# Altium project FastestCar-Motor.PrjPcb
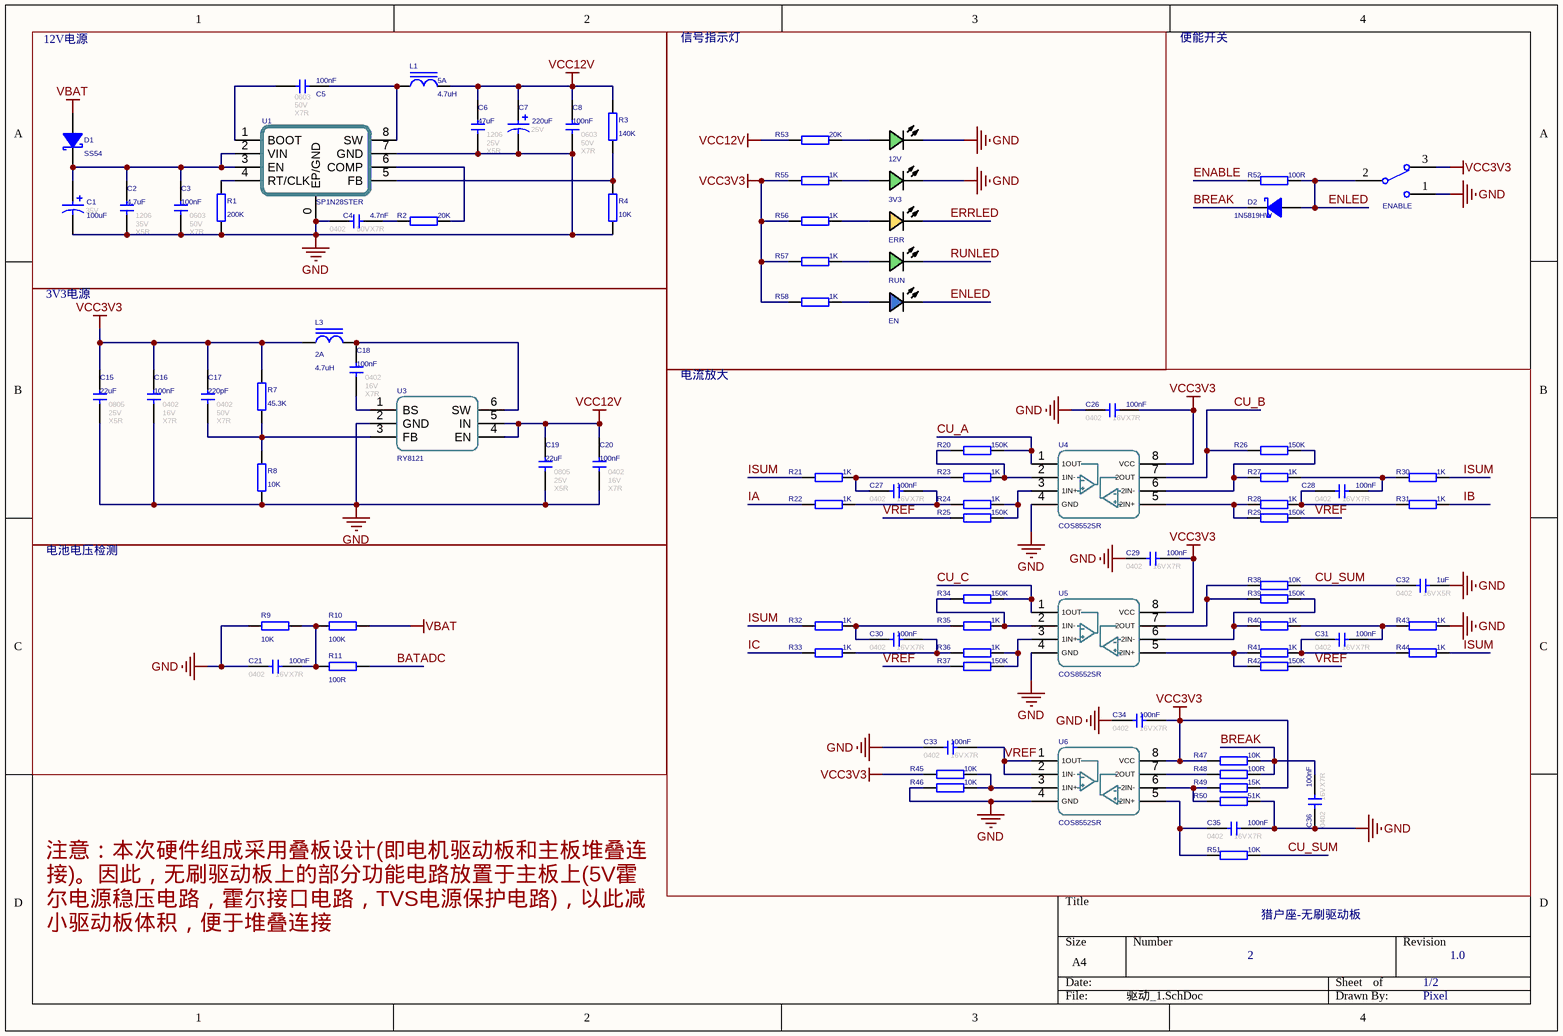
[diagram p0: 驱动_1.SchDoc]
2 sheets, 145 parts. Net scope: global (net labels, ports and power ports of the same name join across sheets).
Board file: 驱动.PcbDoc
Sheets:
  驱动_1.SchDoc
  驱动_2.SchDoc

## Sheet 驱动_1.SchDoc
size A4; SheetNumber: 1; SheetTotal: 2

### Parts
3V3  翠绿贴片LED  [LEDC1608(0603)-L]  (value not drawn)
12V  翠绿贴片LED  [LEDC1608(0603)-L]  (value not drawn)
C1  value 100uF  Voltage: 35V  [CAP-E-S 6.3]  (hidden comment: 100uF 35V 铝电解)
C2  value 4.7uF  FootPrint: 1206  Voltage: 35V  Type: X5R  [CAPC3216[1206]S]  (hidden comment: 4.7uF 35V X5R)
C3  value 100nF  FootPrint: 0603  Voltage: 50V  Type: X7R  [CAPC1608[0603]S-N]  (hidden comment: 100nF 50V X7R)
C4  value 4.7nF  FootPrint: 0402  Voltage: 50V  Type: X7R  [CAPC1005[0402]S-N]  (hidden comment: 4.7nF 50V X7R)
C5  value 100nF  FootPrint: 0603  Voltage: 50V  Type: X7R  [CAPC1608[0603]S-N]  (hidden comment: 100nF 50V X7R)
C6  value 47uF  FootPrint: 1206  Voltage: 25V  Type: X5R  [CAPC3216[1206]S]  (hidden comment: 47uF 25V X5R)
C7  value 220uF  Voltage: 25V  [CAP-E-S 6.3]  (hidden comment: 220uF 25V 铝电解)
C8  value 100nF  FootPrint: 0603  Voltage: 50V  Type: X7R  [CAPC1608[0603]S-N]  (hidden comment: 100nF 50V X7R)
C15  value 22uF  FootPrint: 0805  Voltage: 25V  Type: X5R  [CAPC2012[0805]S-N]  (hidden comment: 22uF 25V X5R)
C16  value 100nF  FootPrint: 0402  Voltage: 16V  Type: X7R  [CAPC1005[0402]S-N]  (hidden comment: 100nF 16V X7R)
C17  value 220pF  FootPrint: 0402  Voltage: 50V  Type: X7R  [CAPC1005[0402]S-N]  (hidden comment: 220pF 50V X7R)
C18  value 100nF  FootPrint: 0402  Voltage: 16V  Type: X7R  [CAPC1005[0402]S-N]  (hidden comment: 100nF 16V X7R)
C19  value 22uF  FootPrint: 0805  Voltage: 25V  Type: X5R  [CAPC2012[0805]S-N]  (hidden comment: 22uF 25V X5R)
C20  value 100nF  FootPrint: 0402  Voltage: 16V  Type: X7R  [CAPC1005[0402]S-N]  (hidden comment: 100nF 16V X7R)
C21  value 100nF  FootPrint: 0402  Voltage: 16V  Type: X7R  [CAPC1005[0402]S-N]  (hidden comment: 100nF 16V X7R)
C26  value 100nF  FootPrint: 0402  Voltage: 16V  Type: X7R  [CAPC1005[0402]S-N]  (hidden comment: 100nF 16V X7R)
C27  value 100nF  FootPrint: 0402  Voltage: 16V  Type: X7R  [CAPC1005[0402]S-N]  (hidden comment: 100nF 16V X7R)
C28  value 100nF  FootPrint: 0402  Voltage: 16V  Type: X7R  [CAPC1005[0402]S-N]  (hidden comment: 100nF 16V X7R)
C29  value 100nF  FootPrint: 0402  Voltage: 16V  Type: X7R  [CAPC1005[0402]S-N]  (hidden comment: 100nF 16V X7R)
C30  value 100nF  FootPrint: 0402  Voltage: 16V  Type: X7R  [CAPC1005[0402]S-N]  (hidden comment: 100nF 16V X7R)
C31  value 100nF  FootPrint: 0402  Voltage: 16V  Type: X7R  [CAPC1005[0402]S-N]  (hidden comment: 100nF 16V X7R)
C32  value 1uF  FootPrint: 0402  Voltage: 16V  Type: X5R  [CAPC1005[0402]S-N]  (hidden comment: 1uF 16V X5R)
C33  value 100nF  FootPrint: 0402  Voltage: 16V  Type: X7R  [CAPC1005[0402]S-N]  (hidden comment: 100nF 16V X7R)
C34  value 100nF  FootPrint: 0402  Voltage: 16V  Type: X7R  [CAPC1005[0402]S-N]  (hidden comment: 100nF 16V X7R)
C35  value 100nF  FootPrint: 0402  Voltage: 16V  Type: X7R  [CAPC1005[0402]S-N]  (hidden comment: 100nF 16V X7R)
C36  value 100nF  FootPrint: 0402  Voltage: 16V  Type: X7R  [CAPC1005[0402]S-N]  (hidden comment: 100nF 16V X7R)
D1  SS54  [SMA-L[DO-214AC]]
D2  1N5819HW  [SOD-123-L]
EN  蓝色贴片LED  [LEDC1608(0603)-L]  (value not drawn)
ENABLE  SW-SPDT  [SS12D10]  (value not drawn)
ERR  黄色贴片LED  [LEDC1608(0603)-L]  (value not drawn)
L1  value 4.7uH  Imax: 5A  [SLO2520]  (hidden comment: 4.7uH 5A)
L3  value 4.7uH  Imax: 2A  [SLO2520]  (hidden comment: 4.7uH 2A)
R1  value 200K  [RESC1005[0402]S-N]  (hidden comment: 200K ±1%)
R2  value 20K  [RESC1005[0402]S-N]  (hidden comment: 20K ±1%)
R3  value 140K  [RESC1005[0402]S-N]  (hidden comment: 140K ±1%)
R4  value 10K  [RESC1005[0402]S-N]  (hidden comment: 10K ±1%)
R7  value 45.3K  [RESC1005[0402]S-N]  (hidden comment: 45.3K ±1%)
R8  value 10K  [RESC1005[0402]S-N]  (hidden comment: 10K ±1%)
R9  value 10K  [RESC1005[0402]S-N]  (hidden comment: 10K ±1%)
R10  value 100K  [RESC1005[0402]S-N]  (hidden comment: 100K ±1%)
R11  value 100R  [RESC1005[0402]S-N]  (hidden comment: 100R ±1%)
R20  value 150K  [RESC1005[0402]S-N]  (hidden comment: 150K ±1%)
R21  value 1K  [RESC1005[0402]S-N]  (hidden comment: 1K ±1%)
R22  value 1K  [RESC1005[0402]S-N]  (hidden comment: 1K ±1%)
R23  value 1K  [RESC1005[0402]S-N]  (hidden comment: 1K ±1%)
R24  value 1K  [RESC1005[0402]S-N]  (hidden comment: 1K ±1%)
R25  value 150K  [RESC1005[0402]S-N]  (hidden comment: 150K ±1%)
R26  value 150K  [RESC1005[0402]S-N]  (hidden comment: 150K ±1%)
R27  value 1K  [RESC1005[0402]S-N]  (hidden comment: 1K ±1%)
R28  value 1K  [RESC1005[0402]S-N]  (hidden comment: 1K ±1%)
R29  value 150K  [RESC1005[0402]S-N]  (hidden comment: 150K ±1%)
R30  value 1K  [RESC1005[0402]S-N]  (hidden comment: 1K ±1%)
R31  value 1K  [RESC1005[0402]S-N]  (hidden comment: 1K ±1%)
R32  value 1K  [RESC1005[0402]S-N]  (hidden comment: 1K ±1%)
R33  value 1K  [RESC1005[0402]S-N]  (hidden comment: 1K ±1%)
R34  value 150K  [RESC1005[0402]S-N]  (hidden comment: 150K ±1%)
R35  value 1K  [RESC1005[0402]S-N]  (hidden comment: 1K ±1%)
R36  value 1K  [RESC1005[0402]S-N]  (hidden comment: 1K ±1%)
R37  value 150K  [RESC1005[0402]S-N]  (hidden comment: 150K ±1%)
R38  value 10K  [RESC1005[0402]S-N]  (hidden comment: 10K ±1%)
R39  value 150K  [RESC1005[0402]S-N]  (hidden comment: 150K ±1%)
R40  value 1K  [RESC1005[0402]S-N]  (hidden comment: 1K ±1%)
R41  value 1K  [RESC1005[0402]S-N]  (hidden comment: 1K ±1%)
R42  value 150K  [RESC1005[0402]S-N]  (hidden comment: 150K ±1%)
R43  value 1K  [RESC1005[0402]S-N]  (hidden comment: 1K ±1%)
R44  value 1K  [RESC1005[0402]S-N]  (hidden comment: 1K ±1%)
R45  value 10K  [RESC1005[0402]S-N]  (hidden comment: 10K ±1%)
R46  value 10K  [RESC1005[0402]S-N]  (hidden comment: 10K ±1%)
R47  value 10K  [RESC1005[0402]S-N]  (hidden comment: 10K ±1%)
R48  value 100R  [RESC1005[0402]S-N]  (hidden comment: 100R ±1%)
R49  value 15K  [RESC1005[0402]S-N]  (hidden comment: 15K ±1%)
R50  value 51K  [RESC1005[0402]S-N]  (hidden comment: 51K ±1%)
R51  value 10K  [RESC1005[0402]S-N]  (hidden comment: 10K ±1%)
R52  value 100R  [RESC1005[0402]S-N]  (hidden comment: 100R ±1%)
R53  value 20K  [RESC1005[0402]S-N]  (hidden comment: 20K ±1%)
R55  value 1K  [RESC1005[0402]S-N]  (hidden comment: 1K ±1%)
R56  value 1K  [RESC1005[0402]S-N]  (hidden comment: 1K ±1%)
R57  value 1K  [RESC1005[0402]S-N]  (hidden comment: 1K ±1%)
R58  value 1K  [RESC1005[0402]S-N]  (hidden comment: 1K ±1%)
RUN  翠绿贴片LED  [LEDC1608(0603)-L]  (value not drawn)
U1  SP1N28STER  [SOP-8E]
U3  RY8121  [SOT-23-6]
U4  COS8552SR  [SOP-8]
U5  COS8552SR  [SOP-8]
U6  COS8552SR  [SOP-8]

### Blocks framed on the sheet
12V电源: C1-C8 D1 L1 R1-R4 U1
信号指示灯: 3V3 12V EN ERR R53 R55-R58 RUN
3V3电源: C15-C20 L3 R7 R8 U3
电流放大: C26-C36 R20-R51 U4-U6
电池电压检测: C21 R9-R11

### Nets
GND: 3V3.C 12V.C C1.2 C2.1 C3.1 C4.1 C6.1 C7.2 C8.1 C15.1 C16.1 C19.1 C20.1 C21.1 C26.1 C29.1 C32.2 C33.1 C34.1 C35.2 C36.1 ENABLE.1 R1.1 R4.1 R8.1 R9.1 R43.1 R46.1 R50.2 U1.0(EP/GND) U1.7(GND) U3.2(GND) U4.4(GND) U5.4(GND) U6.4(GND)
VBAT: D1.A R10.2
VCC3V3: C15.2 C16.2 C17.2 C26.2 C29.2 C34.2 ENABLE.3 L3.1 R7.2 R45.1 R47.1 R49.2 R55.1 R56.1 R57.1 R58.1 U4.8(VCC) U5.8(VCC) U6.8(VCC)
VCC12V: C6.2 C7.1 C8.2 C19.2 C20.2 L1.2 R3.2 R53.1 U3.4(EN) U3.5(IN)
BATADC: R11.2
BREAK: C36.2 D2.K R47.2 R48.2
CU_A: R20.2 U4.1(1OUT)
CU_B: R26.2 U4.7(2OUT)
CU_C: R34.2 U5.1(1OUT)
CU_SUM: C32.1 R38.2 R51.2
ENABLE: R52.1
ENLED: D2.A EN.C ENABLE.2 R52.2
ERRLED: ERR.C
IA: R22.1
IB: R31.1
IC: R33.1
ISUM: R21.1 R30.1 R32.1 R44.1
RUNLED: RUN.C
VREF: C33.2 R25.1 R29.1 R37.1 R42.1 U6.1(1OUT) U6.2(1IN-)
Net3V3_A: 3V3.A R55.2
Net12V_A: 12V.A R53.2
NetC1_1: C1.1 C2.2 C3.2 D1.K U1.2(VIN) U1.3(EN)
NetC4_2: C4.2 R2.1
NetC5_1: C5.1 U1.1(BOOT)
NetC5_2: C5.2 L1.1 U1.8(SW)
NetC17_1: C17.1 R7.1 R8.2 U3.3(FB)
NetC18_1: C18.1 U3.1(BS)
NetC18_2: C18.2 L3.2 U3.6(SW)
NetC21_2: C21.2 R9.2 R10.1 R11.1
NetC27_1: C27.1 R21.2 R23.1
NetC27_2: C27.2 R22.2 R24.1
NetC28_1: C28.1 R27.1 R30.2
NetC28_2: C28.2 R28.1 R31.2
NetC30_1: C30.1 R32.2 R35.1
NetC30_2: C30.2 R33.2 R36.1
NetC31_1: C31.1 R40.1 R43.2
NetC31_2: C31.2 R41.1 R44.2
NetC35_1: C35.1 R51.1 U6.5(2IN+)
NetEN_A: EN.A R58.2
NetERR_A: ERR.A R56.2
NetR1_2: R1.2 U1.4(RT/CLK)
NetR2_2: R2.2 U1.6(COMP)
NetR3_1: R3.1 R4.2 U1.5(FB)
NetR20_1: R20.1 R23.2 U4.2(1IN-)
NetR24_2: R24.2 R25.2 U4.3(1IN+)
NetR26_1: R26.1 R27.2 U4.6(2IN-)
NetR28_2: R28.2 R29.2 U4.5(2IN+)
NetR34_1: R34.1 R35.2 U5.2(1IN-)
NetR36_2: R36.2 R37.2 U5.3(1IN+)
NetR38_1: R38.1 R39.2 U5.7(2OUT)
NetR39_1: R39.1 R40.2 U5.6(2IN-)
NetR41_2: R41.2 R42.2 U5.5(2IN+)
NetR45_2: R45.2 R46.2 U6.3(1IN+)
NetR48_1: R48.1 U6.7(2OUT)
NetR49_1: R49.1 R50.1 U6.6(2IN-)
NetR57_2: R57.2 RUN.A

### Notes on the sheet
- 使能开关
- 猎户座-无刷驱动板
- 注意：本次硬件组成采用叠板设计(即电机驱动板和主板堆叠连接)。因此，无刷驱动板上的部分功能电路放置于主板上(5V霍尔电源稳压电路，霍尔接口电路，TVS电源保护电路)，以此减小驱动板体积，便于堆叠连接
- 2
- 1/2
- 1.0
- Pixel

### Library data of the parts
3V3 12V RUN = LED Chip Green: Published: 8-Jun-2000; Revision: July-2002: Re-released for DXP Platform.; Publisher: Altium Limited; Price(RMB): 0.00
C1 = E-S 100uF 35V 6.3x7.7: 贴片电解电容 100uF 35V 6.3x7.7; Revision: V1.0; Type: 铝电解
C2 = 4.7uF 1206 35V X5R: 贴片瓷片电容; MLCC; 1206(3216);; Revision: V1.0
C3 C5 C8 = 100nF 0603 50V X7R: 贴片瓷片电容; MLCC; 0603(1608);; Revision: V1.0
C4 = 4.7nF 0402 50V X7R: 贴片瓷片电容; MLCC; 0402(1005);; Revision: V1.0
C6 = 47uF 1206 25V X5R: 贴片瓷片电容; MLCC; 1206(3216);; Revision: V1.0
C7 = E-S 220uF 25V 6.3x7.7: 贴片电解电容 220uF 25V 6.3x7.7; Revision: V1.0; Type: 铝电解
C15 C19 = 22uF 0805 25V X5R: 贴片瓷片电容; MLCC; 0805(2012);; Revision: V1.0
C16 C18 C20 C21 C26-C31 C33-C36 = 100nF 0402 16V X7R: 贴片瓷片电容; MLCC; 0402(1005);; Revision: V1.0
C17 = 220pF 0402 50V X7R: 贴片瓷片电容; MLCC; 0402(1005);; Revision: V1.0
C32 = 1uF 0402 16V X5R: 贴片瓷片电容; MLCC; 0402(1005);; Revision: V1.0
D1 = SS54: SS54 肖特基二极管; Revision: V1.0; Value: SS54
D2 = 1N5819HW: 1N5819HW 肖特基二极管; Revision: V1.0; Value: 1N5819HW
EN = LED Chip Blue: Published: 8-Jun-2000; Revision: July-2002: Re-released for DXP Platform.; Publisher: Altium Limited; Price(RMB): 0.00; Color: Blue
ENABLE = SW-SPDT: 单刀双掷开关 3脚船型、钮子、拨动开关 SPDT Subminiature Toggle Switch; Published: 24-Mar-1999; Publisher: Altium Limited; Price(RMB): 0.000
ERR = LED Chip Yellow: Published: 8-Jun-2000; Revision: July-2002: Re-released for DXP Platform.; Publisher: Altium Limited; Price(RMB): 0.00
L1 L3 = Ind-Power: 功率电感; DCR: .5m; Published: 8-Jun-2000; Revision: July-2002: Re-released for DXP Platform.; Publisher: Altium Limited; Price(RMB): 0.000
R1 = Res-Chip_10: 贴片电阻; Power: 1/8W; Revision: V1.0; Tolerance: ±1%
R2 R53 = Res-Chip_7: 贴片电阻; Power: 1/8W; Revision: V1.0; Tolerance: ±1%
R3 = Res-Chip_11: 贴片电阻; Power: 1/8W; Revision: V1.0; Tolerance: ±1%
R4 R8 R9 R38 R45-R47 R51 = Res-Chip_1: 贴片电阻; Power: 1/8W; Revision: V1.0; Tolerance: ±1%
R7 = Res-Chip_12: 贴片电阻; Power: 1/8W; Revision: V1.0; Tolerance: ±1%
R10 = Res-Chip_9: 贴片电阻; Power: 1/8W; Revision: V1.0; Tolerance: ±1%
R11 R48 R52 = Res-Chip_5: 贴片电阻; Power: 1/8W; Revision: V1.0; Tolerance: ±1%
R20 R25 R26 R29 R34 R37 R39 R42 = Res-Chip_13: 贴片电阻; Power: 1/8W; Revision: V1.0; Tolerance: ±1%
R21-R24 R27 R28 R30-R33 R35 R36 R40 R41 R43 R44 R55-R58 = Res-Chip_6: 贴片电阻; Power: 1/8W; Revision: V1.0; Tolerance: ±1%
R49 = Res-Chip_15: 贴片电阻; Power: 1/8W; Revision: V1.0; Tolerance: ±1%
R50 = Res-Chip_14: 贴片电阻; Power: 1/8W; Revision: V1.0; Tolerance: ±1%
U3 = RY8121: 18V 2A 1MHz Synchronous Step-Down Regulator
U4-U6 = COS8552SR: COS8552SR 二路通用运算放大器
U1 = SP1N28STER: Revision: V1.0; Value: SP1N28STER

## Sheet 驱动_2.SchDoc
size A4; SheetNumber: 2; SheetTotal: 2
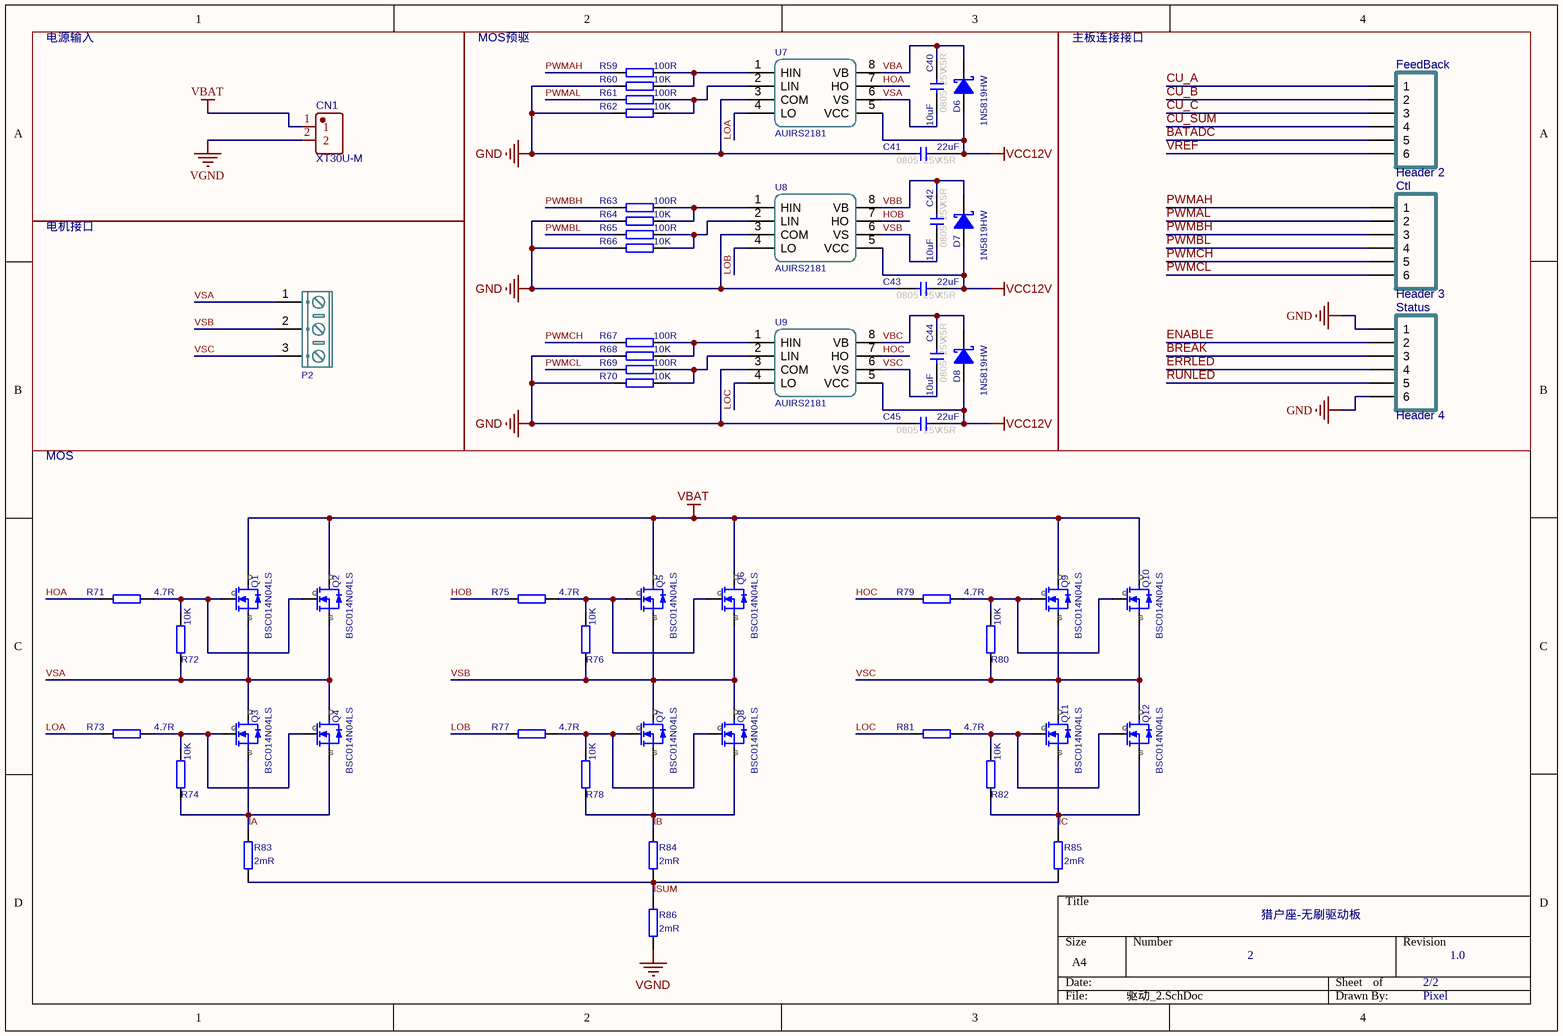
[diagram p1: 驱动_2.SchDoc]

### Parts
C40  value 10uF  FootPrint: 0805  Voltage: 25V  Type: X5R  [CAPC2012[0805]S-N]  (hidden comment: 10uF 25V X5R)
C41  value 22uF  FootPrint: 0805  Voltage: 25V  Type: X5R  [CAPC2012[0805]S-N]  (hidden comment: 22uF 25V X5R)
C42  value 10uF  FootPrint: 0805  Voltage: 25V  Type: X5R  [CAPC2012[0805]S-N]  (hidden comment: 10uF 25V X5R)
C43  value 22uF  FootPrint: 0805  Voltage: 25V  Type: X5R  [CAPC2012[0805]S-N]  (hidden comment: 22uF 25V X5R)
C44  value 10uF  FootPrint: 0805  Voltage: 25V  Type: X5R  [CAPC2012[0805]S-N]  (hidden comment: 10uF 25V X5R)
C45  value 22uF  FootPrint: 0805  Voltage: 25V  Type: X5R  [CAPC2012[0805]S-N]  (hidden comment: 22uF 25V X5R)
CN1  XT30U-M  [CONN-TH_XT30U-M]
Ctl  Header 3  [ZH1.5-6P-SH]
D6  1N5819HW  [SOD-123-L]
D7  1N5819HW  [SOD-123-L]
D8  1N5819HW  [SOD-123-L]
FeedBack  Header 2  [ZH1.5-6P-SH]
P2  KF/WJ/DG 30x connecter  [KF/WJ/DG 301-3p-5.0mm]  (value not drawn)
Q1  BSC014N04LS  [TDSON-8]
Q2  BSC014N04LS  [TDSON-8]
Q3  BSC014N04LS  [TDSON-8]
Q4  BSC014N04LS  [TDSON-8]
Q5  BSC014N04LS  [TDSON-8]
Q6  BSC014N04LS  [TDSON-8]
Q7  BSC014N04LS  [TDSON-8]
Q8  BSC014N04LS  [TDSON-8]
Q9  BSC014N04LS  [TDSON-8]
Q10  BSC014N04LS  [TDSON-8]
Q11  BSC014N04LS  [TDSON-8]
Q12  BSC014N04LS  [TDSON-8]
R59  value 100R  [RESC1005[0402]S-N]  (hidden comment: 100R ±1%)
R60  value 10K  [RESC1005[0402]S-N]  (hidden comment: 10K ±1%)
R61  value 100R  [RESC1005[0402]S-N]  (hidden comment: 100R ±1%)
R62  value 10K  [RESC1005[0402]S-N]  (hidden comment: 10K ±1%)
R63  value 100R  [RESC1005[0402]S-N]  (hidden comment: 100R ±1%)
R64  value 10K  [RESC1005[0402]S-N]  (hidden comment: 10K ±1%)
R65  value 100R  [RESC1005[0402]S-N]  (hidden comment: 100R ±1%)
R66  value 10K  [RESC1005[0402]S-N]  (hidden comment: 10K ±1%)
R67  value 100R  [RESC1005[0402]S-N]  (hidden comment: 100R ±1%)
R68  value 10K  [RESC1005[0402]S-N]  (hidden comment: 10K ±1%)
R69  value 100R  [RESC1005[0402]S-N]  (hidden comment: 100R ±1%)
R70  value 10K  [RESC1005[0402]S-N]  (hidden comment: 10K ±1%)
R71  value 4.7R  [RESC1608[0603]S-N]  (hidden comment: 4.7R ±1%)
R72  value 10K  [RESC1005[0402]S-N]  (hidden comment: 10K ±1%)
R73  value 4.7R  [RESC1608[0603]S-N]  (hidden comment: 4.7R ±1%)
R74  value 10K  [RESC1005[0402]S-N]  (hidden comment: 10K ±1%)
R75  value 4.7R  [RESC1608[0603]S-N]  (hidden comment: 4.7R ±1%)
R76  value 10K  [RESC1005[0402]S-N]  (hidden comment: 10K ±1%)
R77  value 4.7R  [RESC1608[0603]S-N]  (hidden comment: 4.7R ±1%)
R78  value 10K  [RESC1005[0402]S-N]  (hidden comment: 10K ±1%)
R79  value 4.7R  [RESC1608[0603]S-N]  (hidden comment: 4.7R ±1%)
R80  value 10K  [RESC1005[0402]S-N]  (hidden comment: 10K ±1%)
R81  value 4.7R  [RESC1608[0603]S-N]  (hidden comment: 4.7R ±1%)
R82  value 10K  [RESC1005[0402]S-N]  (hidden comment: 10K ±1%)
R83  value 2mR  [RESC6332[2512]S]  (hidden comment: 2mR ±1%)
R84  value 2mR  [RESC6332[2512]S]  (hidden comment: 2mR ±1%)
R85  value 2mR  [RESC6332[2512]S]  (hidden comment: 2mR ±1%)
R86  value 2mR  [RESC6332[2512]S]  (hidden comment: 2mR ±1%)
Status  Header 4  [ZH1.5-6P-SH]
U7  AUIRS2181  [SOP-8]
U8  AUIRS2181  [SOP-8]
U9  AUIRS2181  [SOP-8]

### Blocks framed on the sheet
电源输入: CN1
MOS预驱: C40-C45 D6-D8 R59-R70 U7-U9
主板连接接口: Ctl FeedBack Status
电机接口: P2

### Nets
GND: C41.1 C43.1 C45.1 R60.1 R62.1 R64.1 R66.1 R68.1 R70.1 Status.1 Status.6 U7.3(COM) U8.3(COM) U9.3(COM)
VBAT: CN1.1 Q1.1(D) Q2.1(D) Q5.1(D) Q6.1(D) Q9.1(D) Q10.1(D)
VCC12V: C41.2 C43.2 C45.2 D6.A D7.A D8.A U7.5(VCC) U8.5(VCC) U9.5(VCC)
VGND: CN1.2 R86.1
BATADC: FeedBack.5
BREAK: Status.3
CU_A: FeedBack.1
CU_B: FeedBack.2
CU_C: FeedBack.3
CU_SUM: FeedBack.4
ENABLE: Status.2
ERRLED: Status.4
HOA: R71.1 U7.7(HO)
HOB: R75.1 U8.7(HO)
HOC: R79.1 U9.7(HO)
IA: Q3.3(S) Q4.3(S) R74.1 R83.2
IB: Q7.3(S) Q8.3(S) R78.1 R84.2
IC: Q11.3(S) Q12.3(S) R82.1 R85.2
ISUM: R83.1 R84.1 R85.1 R86.2
LOA: R73.1 U7.4(LO)
LOB: R77.1 U8.4(LO)
LOC: R81.1 U9.4(LO)
PWMAH: Ctl.1 R59.1
PWMAL: Ctl.2 R61.1
PWMBH: Ctl.3 R63.1
PWMBL: Ctl.4 R65.1
PWMCH: Ctl.5 R67.1
PWMCL: Ctl.6 R69.1
RUNLED: Status.5
VBA: C40.2 D6.K U7.8(VB)
VBB: C42.2 D7.K U8.8(VB)
VBC: C44.2 D8.K U9.8(VB)
VREF: FeedBack.6
VSA: C40.1 P2.1 Q1.3(S) Q2.3(S) Q3.1(D) Q4.1(D) R72.1 U7.6(VS)
VSB: C42.1 P2.2 Q5.3(S) Q6.3(S) Q7.1(D) Q8.1(D) R76.1 U8.6(VS)
VSC: C44.1 P2.3 Q9.3(S) Q10.3(S) Q11.1(D) Q12.1(D) R80.1 U9.6(VS)
NetQ1_2: Q1.2(G) Q2.2(G) R71.2 R72.2
NetQ3_2: Q3.2(G) Q4.2(G) R73.2 R74.2
NetQ5_2: Q5.2(G) Q6.2(G) R75.2 R76.2
NetQ7_2: Q7.2(G) Q8.2(G) R77.2 R78.2
NetQ9_2: Q9.2(G) Q10.2(G) R79.2 R80.2
NetQ11_2: Q11.2(G) Q12.2(G) R81.2 R82.2
NetR59_2: R59.2 R60.2 U7.1(HIN)
NetR61_2: R61.2 R62.2 U7.2(LIN)
NetR63_2: R63.2 R64.2 U8.1(HIN)
NetR65_2: R65.2 R66.2 U8.2(LIN)
NetR67_2: R67.2 R68.2 U9.1(HIN)
NetR69_2: R69.2 R70.2 U9.2(LIN)

### Notes on the sheet
- MOS
- 猎户座-无刷驱动板
- 2
- 2/2
- 1.0
- Pixel

### Library data of the parts
C40 C42 C44 = 10uF 0805 25V X5R: 贴片瓷片电容; MLCC; 0805(2012);; Revision: V1.0
C41 C43 C45 = 22uF 0805 25V X5R: 贴片瓷片电容; MLCC; 0805(2012);; Revision: V1.0
CN1 = XT30U-M: BOM_Manufacturer: AMASS(艾迈斯); Contributor: lcsc; System: Connector; BOM_Supplier: LCSC; BOM_Supplier Part: C99101; BOM_Manufacturer Part: XT30U-M; link: https://atta.szlcsc.com/upload/public/pdf/source/20170606/1496716542582.pdf; BOM_JLCPCB Part Class: Extended Part; spicePre: C; spiceSymbolName: XT30U-M
Ctl FeedBack Status = Header 6: Header, 6-Pin; System: Connector; LatestRevisionDate: 17-Jul-2002; LatestRevisionNote: Re-released for DXP Platform.; Publisher: Altium Limited; Price(RMB): 0.00
D6-D8 = 1N5819HW: 1N5819HW 肖特基二极管; Revision: V1.0; Value: 1N5819HW
P2 = KF/WJ/DG 30x-3P: 接线端子 3Pin
Q1-Q12 = BSC014N04LS: 英飞凌 N沟 MOS
R59 R61 R63 R65 R67 R69 = Res-Chip_5: 贴片电阻; Power: 1/8W; Revision: V1.0; Tolerance: ±1%
R60 R62 R64 R66 R68 R70 R72 R74 R76 R78 R80 R82 = Res-Chip_1: 贴片电阻; Power: 1/8W; Revision: V1.0; Tolerance: ±1%
R71 R73 R75 R77 R79 R81 = Res-Chip_16: 贴片电阻; Power: 1/8W; Revision: V1.0; Tolerance: ±1%
R83-R86 = Res-Chip_17: 贴片电阻; Power: 1/8W; Revision: V1.0; Tolerance: ±1%

## Nets that join several sheets
GND: 驱动_1 (35 pins), 驱动_2 (14 pins)
VBAT: 驱动_1 (D1.A R10.2), 驱动_2 (7 pins)
VCC12V: 驱动_1 (10 pins), 驱动_2 (9 pins)
BATADC: 驱动_1 (R11.2), 驱动_2 (FeedBack.5)
BREAK: 驱动_1 (C36.2 D2.K R47.2 R48.2), 驱动_2 (Status.3)
CU_A: 驱动_1 (R20.2 U4.1), 驱动_2 (FeedBack.1)
CU_B: 驱动_1 (R26.2 U4.7), 驱动_2 (FeedBack.2)
CU_C: 驱动_1 (R34.2 U5.1), 驱动_2 (FeedBack.3)
CU_SUM: 驱动_1 (C32.1 R38.2 R51.2), 驱动_2 (FeedBack.4)
ENABLE: 驱动_1 (R52.1), 驱动_2 (Status.2)
ERRLED: 驱动_1 (ERR.C), 驱动_2 (Status.4)
IA: 驱动_1 (R22.1), 驱动_2 (Q3.3 Q4.3 R74.1 R83.2)
IB: 驱动_1 (R31.1), 驱动_2 (Q7.3 Q8.3 R78.1 R84.2)
IC: 驱动_1 (R33.1), 驱动_2 (Q11.3 Q12.3 R82.1 R85.2)
ISUM: 驱动_1 (R21.1 R30.1 R32.1 R44.1), 驱动_2 (R83.1 R84.1 R85.1 R86.2)
RUNLED: 驱动_1 (RUN.C), 驱动_2 (Status.5)
VREF: 驱动_1 (7 pins), 驱动_2 (FeedBack.6)